# Altium schematic sheet POWERAMP.SchDoc
size Tabloid; SheetNumber: 6; SheetTotal: 9
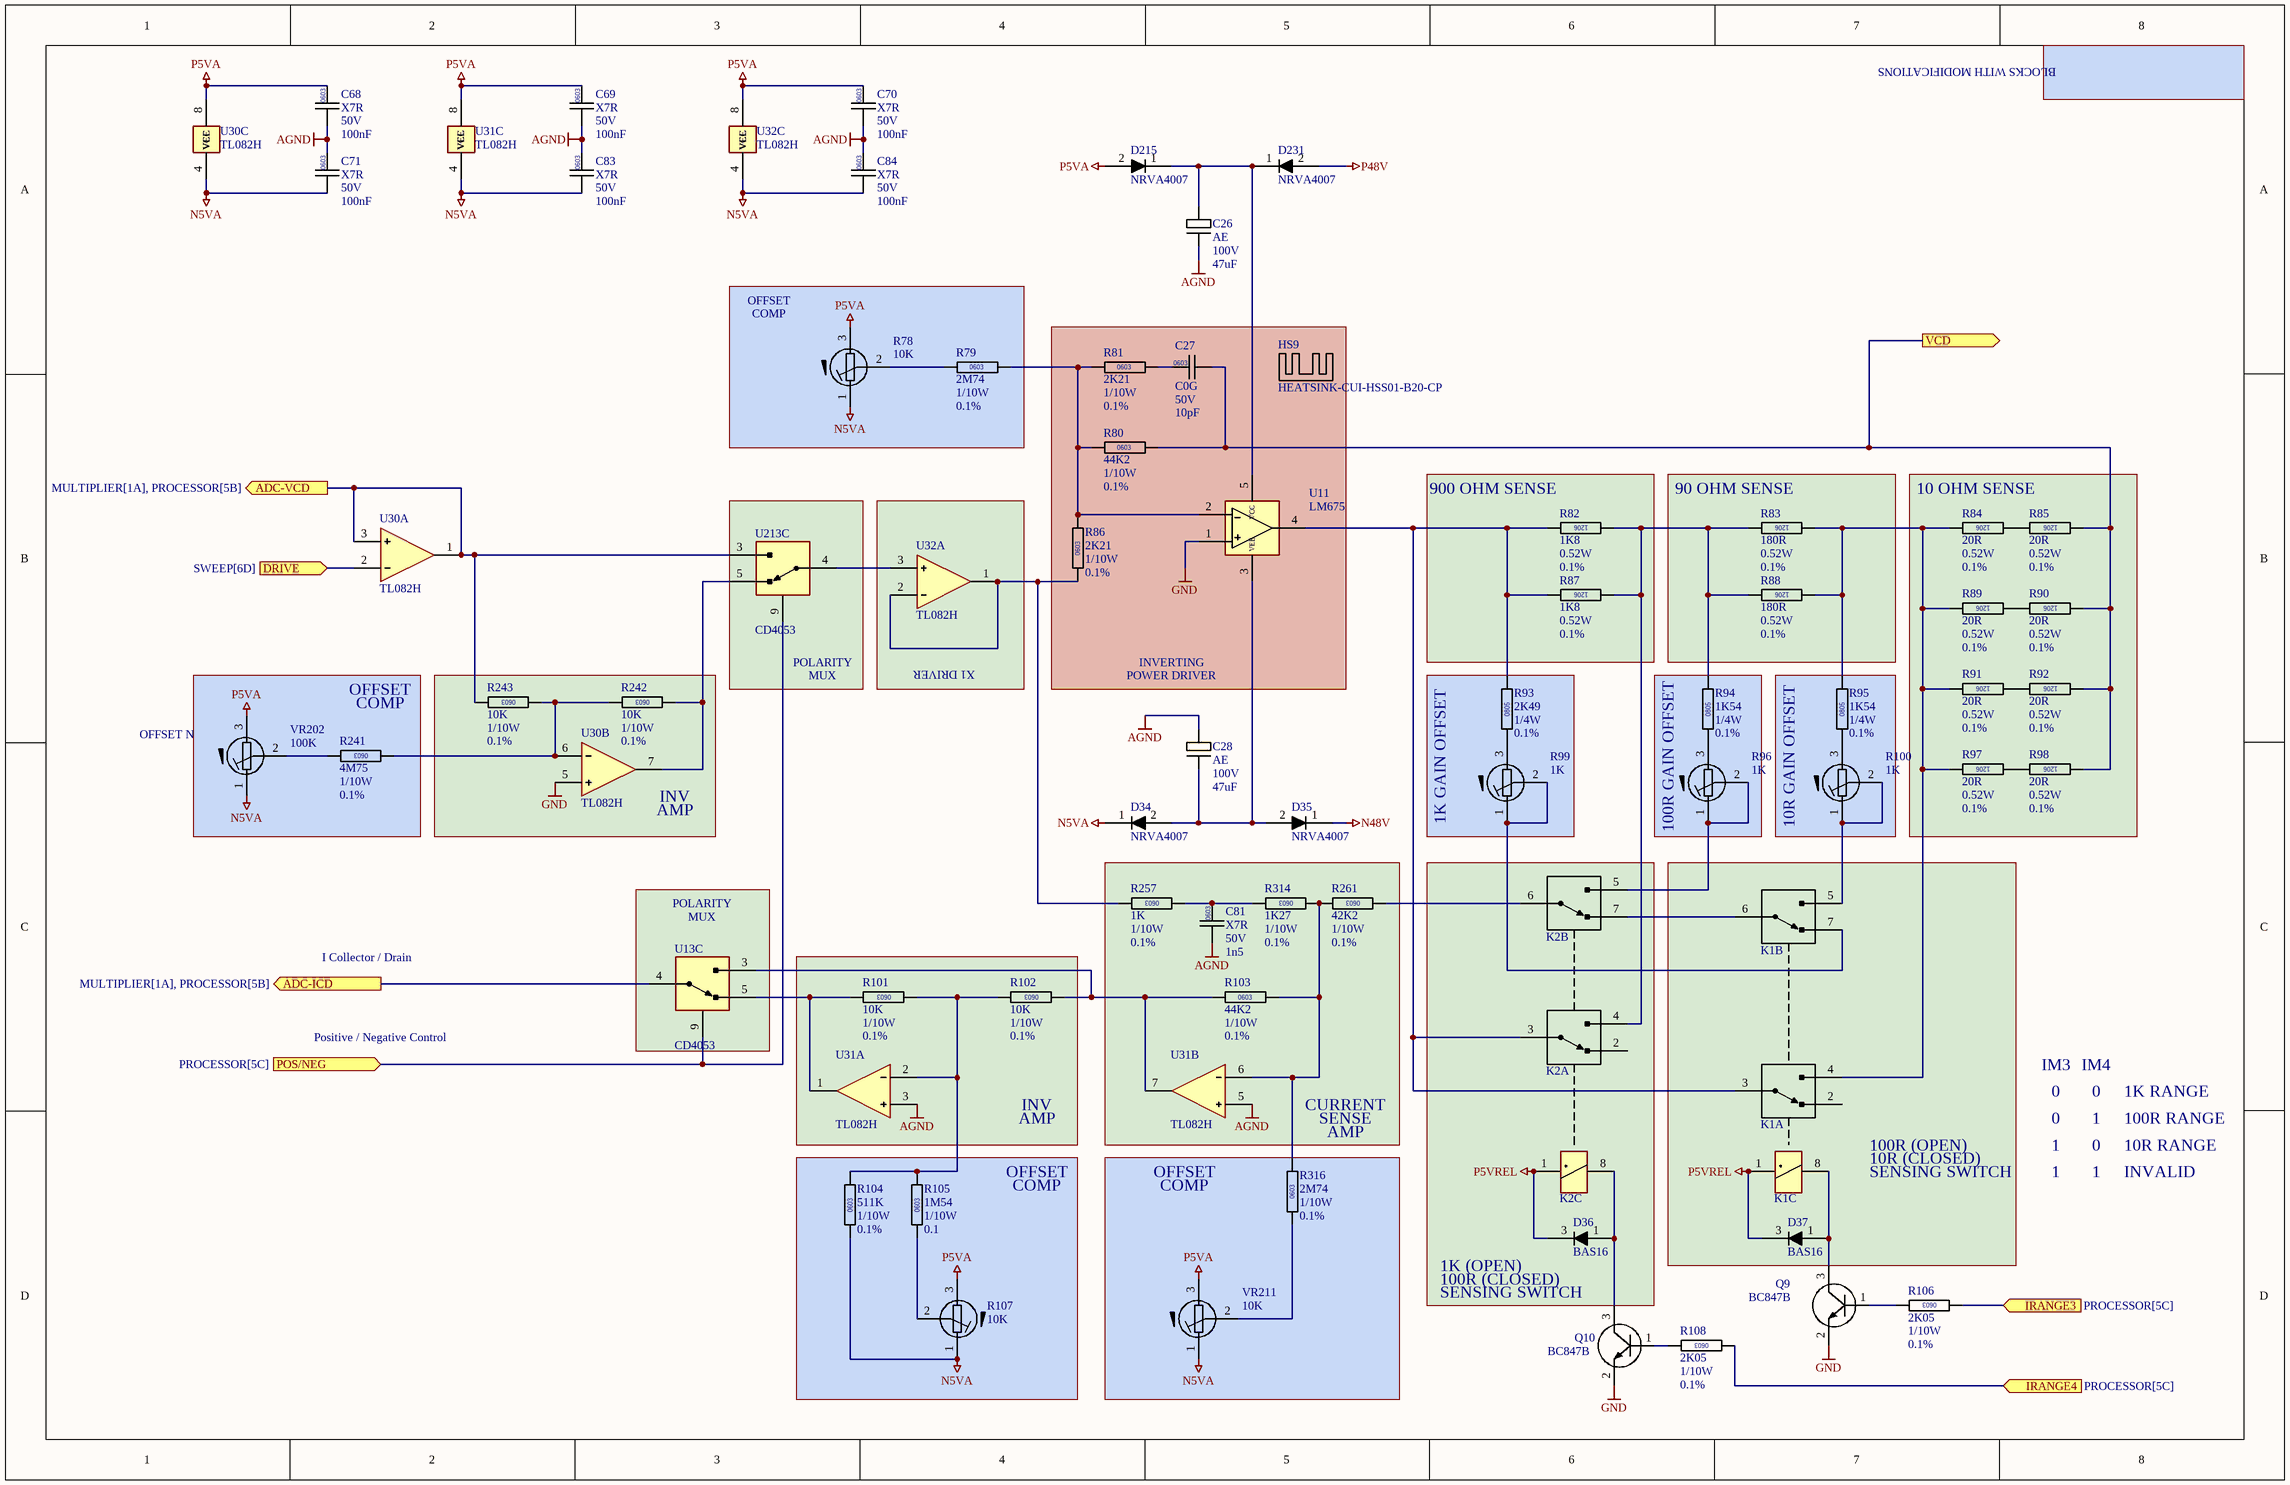
[diagram p0: POWERAMP.SchDoc]

## Parts
C26  Dielectric: AE  Voltage: 100V  Capacitance: 47uF  [CAPAE-KEMET-ESL476M100AH9AA]  (hidden comment: CAP0603)
C27  Dielectric: C0G  Voltage: 50V  Capacitance: 10pF  [CAPC0603]  (hidden comment: CAP0603)
C28  Dielectric: AE  Voltage: 100V  Capacitance: 47uF  [CAPAE-KEMET-ESL476M100AH9AA]  (hidden comment: CAP0603)
C68  Dielectric: X7R  Voltage: 50V  Capacitance: 100nF  [CAPC0603]  (hidden comment: CAP0603)
C69  Dielectric: X7R  Voltage: 50V  Capacitance: 100nF  [CAPC0603]  (hidden comment: CAP0603)
C70  Dielectric: X7R  Voltage: 50V  Capacitance: 100nF  [CAPC0603]  (hidden comment: CAP0603)
C71  Dielectric: X7R  Voltage: 50V  Capacitance: 100nF  [CAPC0603]  (hidden comment: CAP0603)
C81  Dielectric: X7R  Voltage: 50V  Capacitance: 1n5  [CAPC0603]  (hidden comment: CAP0603)
C83  Dielectric: X7R  Voltage: 50V  Capacitance: 100nF  [CAPC0603]  (hidden comment: CAP0603)
C84  Dielectric: X7R  Voltage: 50V  Capacitance: 100nF  [CAPC0603]  (hidden comment: CAP0603)
D34  NRVA4007  [DO214AC]
D35  NRVA4007  [DO214AC]
D36  BAS16  [SOT23]
D37  BAS16  [SOT23]
D215  NRVA4007  [DO214AC]
D231  NRVA4007  [DO214AC]
HS9  HEATSINK-CUI-HSS01-B20-CP  [HEATSINK-CUI-HSS01-B20-CP]
K1  RELAY-KEMET-UA2-5NJ  [RELAY-KEMET-UA2-5NJ]  (value not drawn)  (parts A,B,C of 3)
K2  RELAY-KEMET-UA2-5NJ  [RELAY-KEMET-UA2-5NJ]  (value not drawn)  (parts A,B,C of 3)
Q9  BC847B  [SOT23]
Q10  BC847B  [SOT23]
R78  value 10K  [TRIMMER-BOURNS-3214X]  (hidden comment: TRIMMER-BOURNS-3214X-1-103E)
R79  value 2M74  Power: 1/10W  Tolerance: 0.1%  [RESC0603]  (hidden comment: RESC0603)
R80  value 44K2  Power: 1/10W  Tolerance: 0.1%  [RESC0603]  (hidden comment: RESC0603)
R81  value 2K21  Power: 1/10W  Tolerance: 0.1%  [RESC0603]  (hidden comment: RESC0603)
R82  value 1K8  Power: 0.52W  Tolerance: 0.1%  [RESC1206]  (hidden comment: RESC1206)
R83  value 180R  Power: 0.52W  Tolerance: 0.1%  [RESC1206]  (hidden comment: RESC1206)
R84  value 20R  Power: 0.52W  Tolerance: 0.1%  [RESC1206]  (hidden comment: RESC1206)
R85  value 20R  Power: 0.52W  Tolerance: 0.1%  [RESC1206]  (hidden comment: RESC1206)
R86  value 2K21  Power: 1/10W  Tolerance: 0.1%  [RESC0603]  (hidden comment: RESC0603)
R87  value 1K8  Power: 0.52W  Tolerance: 0.1%  [RESC1206]  (hidden comment: RESC1206)
R88  value 180R  Power: 0.52W  Tolerance: 0.1%  [RESC1206]  (hidden comment: RESC1206)
R89  value 20R  Power: 0.52W  Tolerance: 0.1%  [RESC1206]  (hidden comment: RESC1206)
R90  value 20R  Power: 0.52W  Tolerance: 0.1%  [RESC1206]  (hidden comment: RESC1206)
R91  value 20R  Power: 0.52W  Tolerance: 0.1%  [RESC1206]  (hidden comment: RESC1206)
R92  value 20R  Power: 0.52W  Tolerance: 0.1%  [RESC1206]  (hidden comment: RESC1206)
R93  value 2K49  Power: 1/4W  Tolerance: 0.1%  [RESC0805]  (hidden comment: RESC0805)
R94  value 1K54  Power: 1/4W  Tolerance: 0.1%  [RESC0805]  (hidden comment: RESC0805)
R95  value 1K54  Power: 1/4W  Tolerance: 0.1%  [RESC0805]  (hidden comment: RESC0805)
R96  value 1K  [TRIMMER-BOURNS-3214X]  (hidden comment: TRIMMER-BOURNS-3214X-1-102E)
R97  value 20R  Power: 0.52W  Tolerance: 0.1%  [RESC1206]  (hidden comment: RESC1206)
R98  value 20R  Power: 0.52W  Tolerance: 0.1%  [RESC1206]  (hidden comment: RESC1206)
R99  value 1K  [TRIMMER-BOURNS-3214X]  (hidden comment: TRIMMER-BOURNS-3214X-1-102E)
R100  value 1K  [TRIMMER-BOURNS-3214X]  (hidden comment: TRIMMER-BOURNS-3214X-1-102E)
R101  value 10K  Power: 1/10W  Tolerance: 0.1%  [RESC0603]  (hidden comment: RESC0603)
R102  value 10K  Power: 1/10W  Tolerance: 0.1%  [RESC0603]  (hidden comment: RESC0603)
R103  value 44K2  Power: 1/10W  Tolerance: 0.1%  [RESC0603]  (hidden comment: RESC0603)
R104  value 511K  Power: 1/10W  Tolerance: 0.1%  [RESC0603]  (hidden comment: RESC0603)
R105  value 1M54  Power: 1/10W  Tolerance: 0.1  [RESC0603]  (hidden comment: RESC0603)
R106  value 2K05  Power: 1/10W  Tolerance: 0.1%  [RESC0603]  (hidden comment: RESC0603)
R107  value 10K  [TRIMMER-BOURNS-3214X]  (hidden comment: TRIMMER-BOURNS-3214X-1-103E)
R108  value 2K05  Power: 1/10W  Tolerance: 0.1%  [RESC0603]  (hidden comment: RESC0603)
R241  value 4M75  Power: 1/10W  Tolerance: 0.1%  [RESC0603]  (hidden comment: RESC0603)
R242  value 10K  Power: 1/10W  Tolerance: 0.1%  [RESC0603]  (hidden comment: RESC0603)
R243  value 10K  Power: 1/10W  Tolerance: 0.1%  [RESC0603]  (hidden comment: RESC0603)
R257  value 1K  Power: 1/10W  Tolerance: 0.1%  [RESC0603]  (hidden comment: RESC0603)
R261  value 42K2  Power: 1/10W  Tolerance: 0.1%  [RESC0603]  (hidden comment: RESC0603)
R314  value 1K27  Power: 1/10W  Tolerance: 0.1%  [RESC0603]  (hidden comment: RESC0603)
R316  value 2M74  Power: 1/10W  Tolerance: 0.1%  [RESC0603]  (hidden comment: RESC0603)
U11  LM675  [TO220-5-V]
U13  CD4053  [SO127P600-16N]  (part C of 4)
U30  TL082H  [SO127P600-8N]  (parts A,B,C of 3)
U31  TL082H  [SO127P600-8N]  (parts A,B,C of 3)
U32  TL082H  [SO127P600-8N]  (parts A,C of 3)
U213  CD4053  [SO127P600-16N]  (part C of 4)
VR202  value 100K  [TRIMMER-BOURNS-3214X]  (hidden comment: TRIMMER-BOURNS-3214X-1-104)
VR211  value 10K  [TRIMMER-BOURNS-3214X]  (hidden comment: TRIMMER-BOURNS-3214X-1-103E)

## Blocks framed on the sheet
900 OHM SENSE: R82 R87
90 OHM SENSE: R83 R88
10 OHM SENSE: R84 R85 R89-R92 R97 R98
X1 DRIVER: U32
1K GAIN OFFSET: R93 R99
100R GAIN OFFSET: R94 R96
10R GAIN OFFSET: R95 R100

## Ports
ADC-ICD (out, see MULTIPLIER[1A], PROCESSOR[5B]), ADC-VCD (out, see MULTIPLIER[1A], PROCESSOR[5B]), DRIVE (in, see SWEEP[6D]), IRANGE3 (in, see PROCESSOR[5C]), IRANGE4 (in, see PROCESSOR[5C]), POS/NEG (in, see PROCESSOR[5C]), VCD (out)

## Nets
AGND: C26.2 C28.1 C68.2 C69.2 C70.2 C71.1 C81.2 C83.1 C84.1 U31.3(+) U31.5(+)
GND: Q9.2(E) Q10.2(E) U11.1(+) U30.5(+)
N5VA: C71.2 C83.2 C84.2 D34.1(K) R78.1 R104.2 R107.1 U30.4(VEE) U31.4(VEE) U32.4(VEE) VR202.1 VR211.1
N48V: D35.1(K)
P5VA: C68.1 C69.1 C70.1 D215.2(A) R78.3 R107.3 U30.8(VCC) U31.8(VCC) U32.8(VCC) VR202.3 VR211.3
P5VREL: D36.3(K) D37.3(K) K1.1 K2.1
P48V: D231.2(A)
ADC-ICD: U13.4(Y3) ; port ADC-ICD
ADC-VCD: R243.1 U30.1(O) U30.3(+) U213.3(Y) ; port ADC-VCD
DRIVE: U30.2(-) ; port DRIVE
IRANGE3: R106.1 ; port IRANGE3
IRANGE4: R108.1 ; port IRANGE4
POS/NEG: U13.9(B) U213.9(B) ; port POS/NEG
VCD: C27.2 R80.2 R85.2 R90.2 R92.2 R98.2 ; port VCD
NetC26_1: C26.1 D215.1(K) D231.1(K) U11.5(VCC)
NetC27_1: C27.1 R81.2
NetC28_2: C28.2 D34.2(A) D35.2(A) U11.3(VEE)
NetC81_1: C81.1 R257.2 R314.1
NetD36_1: D36.1(A) K2.8 Q10.3(C)
NetD37_1: D37.1(A) K1.8 Q9.3(C)
NetK1_3: K1.3(COM) K2.3(COM) R82.1 R87.1 R93.1 U11.4(OUT)
NetK1_4: K1.4(NO) R83.2 R84.1 R88.2 R89.1 R91.1 R95.2 R97.1
NetK1_5: K1.5(NO) R100.1 R100.2
NetK1_6: K1.6(COM) K2.7(NC)
NetK1_7: K1.7(NC) R99.1 R99.2
NetK2_4: K2.4(NO) R82.2 R83.1 R87.2 R88.1 R94.2
NetK2_5: K2.5(NO) R96.1 R96.2
NetK2_6: K2.6(COM) R261.2
NetQ9_1: Q9.1(B) R106.2
NetQ10_1: Q10.1(B) R108.2
NetR78_2: R78.2 R79.1
NetR79_2: R79.2 R80.1 R81.1 R86.2 U11.2(-)
NetR84_2: R84.2 R85.1
NetR86_1: R86.1 R257.1 U32.1(O) U32.2(-)
NetR89_2: R89.2 R90.1
NetR91_2: R91.2 R92.1
NetR93_2: R93.2 R99.3
NetR94_1: R94.1 R96.3
NetR95_1: R95.1 R100.3
NetR97_2: R97.2 R98.1
NetR101_1: R101.1 U13.5(Y1) U31.1(O)
NetR101_2: R101.2 R102.1 R104.1 R105.1 U31.2(-)
NetR102_2: R102.2 R103.1 U13.3(Y) U31.7(O)
NetR103_2: R103.2 R261.1 R314.2 R316.2 U31.6(-)
NetR105_2: R105.2 R107.2
NetR241_1: R241.1 VR202.2
NetR241_2: R241.2 R242.1 R243.2 U30.6(-)
NetR242_2: R242.2 U30.7(O) U213.5(Y1)
NetR316_1: R316.1 VR211.2
NetU32_3: U32.3(+) U213.4(Y3)

Not connected (* = marked no-connect by the designer): K1 2(NC); K2 2(NC)

## Notes on the sheet
- BLOCKS WITH MODIFICATIONS
- OFFSET
- COMP
- (near R241) COMP
- POLARITY
- MUX
- POWER DRIVER
- INVERTING
- OFFSET N
- (near U30) INV
- (near U30) AMP
- I Collector / Drain
- (near U13) MUX
- Positive / Negative Control
- INV
- CURRENT
- IM3
- 0
- IM4
- 1K RANGE
- AMP
- SENSE
- (near R316) AMP
- 100R (OPEN)
- SENSING SWITCH
- 10R (CLOSED)
- 1
- INVALID
- 100R RANGE
- 10R RANGE
- 1K (OPEN)
- (near D36) 100R (CLOSED)
- DWG. NO.
- REV.
- SHT.
- THIS DOCUMENT AND THE DATA DISCLOSED HEREIN OR HEREWITH IS THE PROPERTY OF ALTIUM LIMITED AND MAY BE FREELY DISTRIBUTED IN WHOLE. NO RIGHTS ARE RESERVED OR EXPRESS OR IMPLIED WARANTEE GIVEN.
- REVISION
- DESCRIPTION
- DATE
- APPROVED
- ENG:
- APPROVALS
- PROJECT
- DSN:
- CHK:
- REFERENCE DOCUMENTS
- PROJECT REVISION:
- TITLE
- DOCUMENT REVISION:
- DESIGN ITEM:
- BOM:
- FAB DWG:
- PCB DWG:
- ASSY DWG:
- SCALE:
- SIZE
- B
- CAGE CODE
- FILE NAME
- DWG NO.
- SHEET
- OF
- REV
- (in symbol RESC-0603-1K27-0.1%-1/10W) 0603
- (in symbol RESC-0603-1K-0.1%-1/10W) 0603
- (in symbol RESC-0603-1M54-0.1%-1/10W) 0603
- (in symbol RESC-0603-2K05-0.1%-1/10W) 0603
- (in symbol RESC-0603-2K21-0.1%-1/10W) 0603
- (in symbol RESC-0603-2M74-0.1%-1/10W) 0603
- (in symbol RESC-0603-4M75-1%-1/10W) 0603
- (in symbol RESC-0603-10K-0.1%-1/10W) 0603
- (in symbol RESC-0603-42K2-0.1%-1/10W) 0603
- (in symbol RESC-0603-44K2-0.1%-1/10W) 0603
- (in symbol RESC-0603-511K-0.1%-1/10W) 0603
- (in symbol RESC-0805-1K54-0.1%-1/4W) 0805
- (in symbol RESC-0805-2K49-0.1%-1/4W) 0805
- (in symbol RESC-1206-1K8-0.1%-1/2W) 1206
- (in symbol RESC-1206-20R-0.1%-1/2W) 1206
- (in symbol RESC-1206-180R-0.1%-1/2W) 1206

## Library data of the parts
C26 C28 = CAPP-AE-47uF-100V-TH050P100D140H: CAPACITOR,ALU,47uF,100V,TH,P5mm,D10mm,H14mm; Manufacturer 1: KEMET; Manufacturer Part Number 1: ESL476M100AH9AA; Location: *; DIGIKEY: 399-15746-ND
C27 = CAPC-0603-10PF-50V-C0G: CAPACITOR,CERAMIC,10pF,50V,C0G,0603; Manufacturer 1: KYOCERA; Manufacturer Part Number 1: C0603C100J5GAC; Package / Case: 0603; Location: *; MOUSER: 80-C0603C100J5GAC
C68-C71 C83 C84 = CAPC-0603-100nF-50V-X7R: CAPACITOR,CERAMIC,100nF,50V,X7R,0603; Manufacturer 1: KEMET; Manufacturer Part Number 1: C0603C104K5RACTU; Package / Case: 0603; Location: *; Supplier 1: Mouser; Supplier Part Number 1: 80-C0603C104K5R7867; Supplier 2: Mouser; Supplier Part Number 2: 80-C0603C104K5R7411; Supplier 3: Avnet; Supplier Part Number 3: KGM15BR71H104KT; Supplier 4: Digikey; Supplier Part Number 4: 1276-1000-1-ND; LCSC: C127833; MOUSER: 80-C0603C104K5R
C81 = CAPC-0603-1n5-50V-X7R: CAPACITOR,CERAMIC,1n5,50V,X7R,0603; Package / Case: 0603; Location: *
D34 D35 D215 D231 = DIODE-ONSEMI-NRVA4007T3G: DIODE,RECTIFIER,1000V,1A,ONSEMI,NRVA4007,SMA; DIGIKEY: NRVA4007T3GOSCT-ND; Manufacturer 1: ONSEMI; Manufacturer Part Number 1: NRVA4007T3G
D36 D37 = DIODE-RECTIFIER-DIODES-BAS16-SOT23: DIODE,RECTIFIER,75V,0.3A,BAS16,SOT23; Manufacturer 1: ONSEMI; Manufacturer Part Number 1: BAS16LT1G
HS9 = HEATSINK-CUI-HSS01-B20-CP: HEATSINKSTAMPED,CLIP-ON,BOARDMOUNT,3W,25C/W,CUI,HSS01-B20-CP; DIGIKEY: HSS01-B20-CP; Manufacturer 1: CUI; Manufacturer Part Number 1: HSS01-B20-CP
K1 K2 = RELAY-KEMET-UA2-5NJ: RELAY,DPDT,1A,250VAC,220VDC,5V COIL,KEMET,UA2-5NJ; DIGIKEY: 399-UA2-5NJ-ND; Manufacturer 1: KEMET; Manufacturer Part Number 1: UA2-5NJ
Q9 Q10 = XSTR-NPN-BC847: XSTR,NPN,45V,0.1A,,BC847B,SOT23
R78 R107 VR211 = TRIMMER-BOURNS-3214X-1-103E: RESISTOR,MULTITURN,VERTICAL,5T,10K; Manufacturer 1: BOURNS; Manufacturer Part Number 1: 3214X-1-102E
R79 R316 = RESC-0603-2M74-0.1%-1/10W: RESISTOR,2M74,0.1%,100mW,0603 (1608); Location: *
R80 R103 = RESC-0603-44K2-0.1%-1/10W: RESISTOR,44K2,0.1%,100mW,0603 (1608); Location: *
R81 R86 = RESC-0603-2K21-0.1%-1/10W: RESISTOR,2K21,0.1%,100mW,0603 (1608); Location: *
R82 R87 = RESC-1206-1K8-0.1%-1/2W: RESISTOR,1K8,1206,0.1%,520mW,1206; Manufacturer 1: VISHAY; Manufacturer Part Number 1: TNPW12061K80BEEA; Location: *; Parameter 4: *
R83 R88 = RESC-1206-180R-0.1%-1/2W: RESISTOR,180,1206,0.1%,520mW,1206; Manufacturer 1: VISHAY; Manufacturer Part Number 1: TNPW1206180RBEEA; Location: *; Parameter 4: *
R84 R85 R89-R92 R97 R98 = RESC-1206-20R-0.1%-1/2W: RESISTOR,20R,1206,0.1%,520mW,1206; Manufacturer 1: VISHAY; Manufacturer Part Number 1: TNPW120620R0BEEA; Location: *; Parameter 4: *
R93 = RESC-0805-2K49-0.1%-1/4W: RESISTOR,2K49,0.1%,250mW,0805; Manufacturer 1: TE; Manufacturer Part Number 1: RP73PF2A2K49BTDF; Location: *; Parameter 4: *
R94 R95 = RESC-0805-1K54-0.1%-1/4W: RESISTOR,1K54,0.1%,250mW,0805; Manufacturer 1: TE; Manufacturer Part Number 1: RP73PF2A1K54BTDF; Location: *; Parameter 4: *
R96 R99 R100 = TRIMMER-BOURNS-3214X-1-102E: RESISTOR,MULTITURN,VERTICAL,5T,1K; Manufacturer 1: BOURNS; Manufacturer Part Number 1: 3214X-1-102E
R101 R102 R242 R243 = RESC-0603-10K-0.1%-1/10W: RESISTOR,10K,0.1%,100mW,0603 (1608); Manufacturer 1: PANASONIC; Manufacturer Part Number 1: ERA-3AEB103V; Location: *; DIGIKEY: P10KDBCT-ND
R104 = RESC-0603-511K-0.1%-1/10W: RESISTOR,511K,0.1%,100mW,0603 (1608); Location: *
R105 = RESC-0603-1M54-0.1%-1/10W: RESISTOR,1M54,0.1%,100mW,0603 (1608); Location: *
R106 R108 = RESC-0603-2K05-0.1%-1/10W: RESISTOR,2K05,0.11%,100mW,0603 (1608); Location: *
R241 = RESC-0603-4M75-1%-1/10W: RESISTOR,4M75,0.1%,100mW,0603 (1608); Location: *
R257 = RESC-0603-1K-0.1%-1/10W: RESISTOR,1K,0.1%,100mW,0603 (1608); Location: *
R261 = RESC-0603-42K2-0.1%-1/10W: RESISTOR,42K2,0.1%,100mW,0603 (1608); Location: *
R314 = RESC-0603-1K27-0.1%-1/10W: RESISTOR,1K27,0.1%,100mW,0603 (1608); Location: *
U11 = IC-TI-LM675-TO220-5: IC,OPAMP,SINGLE,POWER,LM675,TO220-5
U13 U213 = IC-TI-CD4053-SPLIT: IC,LOGIC,CMOS,4XXX,TRIPLE 2:1 MUX,SPLIT BLOCKS
U30-U32 = IC-TI-TL082H-SO8: IC,OPAMP JFET,DUAL,TL082HIDR,SO8; Manufacturer 1: TI; Manufacturer Part Number 1: TL082HIDR; MOUSER: 595-TL082HIDR
VR202 = TRIMMER-BOURNS-3214X-1-104: RESISTOR,MULTITURN,VERTICAL,5T,100K; Manufacturer 1: BOURNS; Manufacturer Part Number 1: 3214X-1-102E